# Altium schematic sheet MM-08 FPS-400.SchDoc
size A4; SheetNumber: 1; SheetTotal: 8
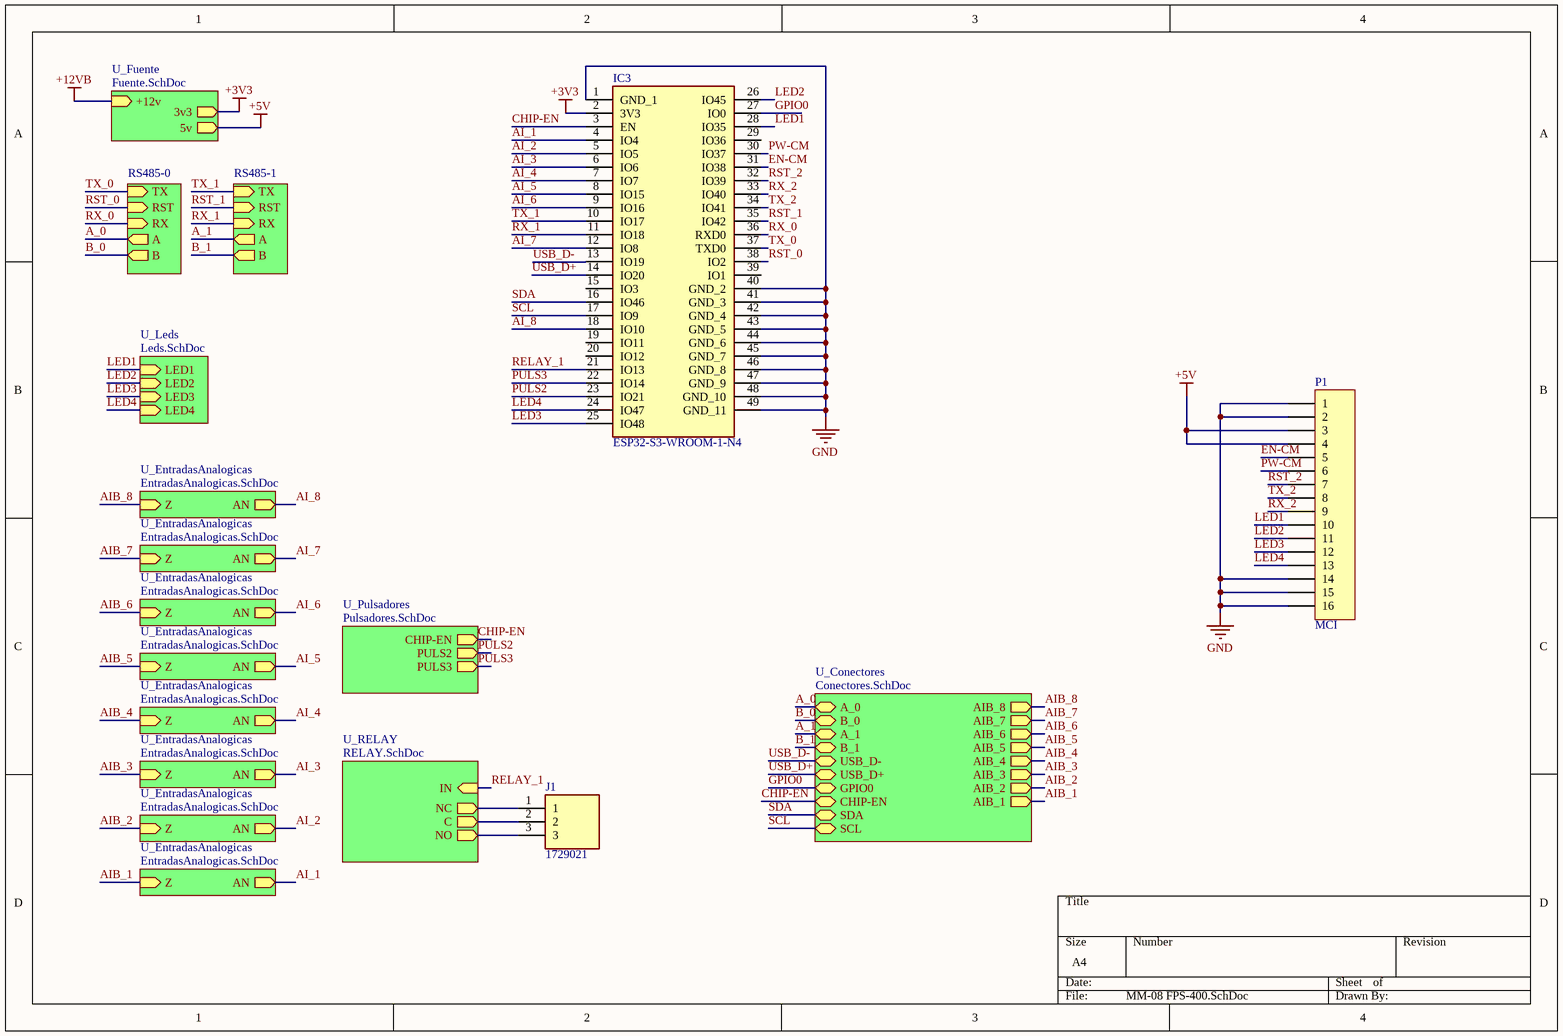
[diagram p0: MM-08 FPS-400.SchDoc]

## Parts
IC3  ESP32-S3-WROOM-1-N4  [Model Name]
J1  1729021  [1729021]
P1  MCI  [HDR1X16]

## Sub-sheets
RS485-0 = RS485.SchDoc: RST (in), RX (in), A (out), B (out), TX (in)
RS485-1 = RS485.SchDoc: RST (in), RX (in), A (out), B (out), TX (in)
U_Conectores = Conectores.SchDoc: A_0 (bidir), B_0 (bidir), A_1 (bidir), B_1 (bidir), USB_D- (bidir), USB_D+ (bidir), GPIO0 (bidir), CHIP-EN (bidir), SDA (bidir), SCL (bidir), AIB_3 (out), AIB_2 (out), AIB_6 (out), AIB_7 (out), AIB_5 (out), AIB_4 (out), AIB_1 (out), AIB_8 (out)
U_EntradasAnalogicas = EntradasAnalogicas.SchDoc: AN (out), Z (in)
U_EntradasAnalogicas = EntradasAnalogicas.SchDoc: AN (out), Z (in)
U_EntradasAnalogicas = EntradasAnalogicas.SchDoc: AN (out), Z (in)
U_EntradasAnalogicas = EntradasAnalogicas.SchDoc: AN (out), Z (in)
U_EntradasAnalogicas = EntradasAnalogicas.SchDoc: AN (out), Z (in)
U_EntradasAnalogicas = EntradasAnalogicas.SchDoc: AN (out), Z (in)
U_EntradasAnalogicas = EntradasAnalogicas.SchDoc: AN (out), Z (in)
U_EntradasAnalogicas = EntradasAnalogicas.SchDoc: AN (out), Z (in)
U_Fuente = Fuente.SchDoc: +12v (in), 3v3 (out), 5v (out)
U_Leds = Leds.SchDoc: LED1 (in), LED2 (in), LED3 (in), LED4 (in)
U_Pulsadores = Pulsadores.SchDoc: CHIP-EN (out), PULS2 (out), PULS3 (out)
U_RELAY = RELAY.SchDoc: IN (in), NC (out), C (out), NO (out)

## Nets
+3V3: IC3.2(3V3) ; sheet U_Fuente/3v3
+5V: P1.3 P1.4 ; sheet U_Fuente/5v
+12VB: sheet U_Fuente/+12v
GND: IC3.1(GND_1) IC3.40(GND_2) IC3.41(GND_3) IC3.42(GND_4) IC3.43(GND_5) IC3.44(GND_6) IC3.45(GND_7) IC3.46(GND_8) IC3.47(GND_9) IC3.48(GND_10) IC3.49(GND_11) P1.1 P1.2 P1.14 P1.15 P1.16
A_0: sheet RS485-0/A, sheet U_Conectores/A_0
A_1: sheet RS485-1/A, sheet U_Conectores/A_1
AI_1: IC3.4(IO4) ; sheet U_EntradasAnalogicas/AN
AI_2: IC3.5(IO5) ; sheet U_EntradasAnalogicas/AN
AI_3: IC3.6(IO6) ; sheet U_EntradasAnalogicas/AN
AI_4: IC3.7(IO7) ; sheet U_EntradasAnalogicas/AN
AI_5: IC3.8(IO15) ; sheet U_EntradasAnalogicas/AN
AI_6: IC3.9(IO16) ; sheet U_EntradasAnalogicas/AN
AI_7: IC3.12(IO8) ; sheet U_EntradasAnalogicas/AN
AI_8: IC3.18(IO10) ; sheet U_EntradasAnalogicas/AN
AIB_1: sheet U_Conectores/AIB_1, sheet U_EntradasAnalogicas/Z
AIB_2: sheet U_Conectores/AIB_2, sheet U_EntradasAnalogicas/Z
AIB_3: sheet U_Conectores/AIB_3, sheet U_EntradasAnalogicas/Z
AIB_4: sheet U_Conectores/AIB_4, sheet U_EntradasAnalogicas/Z
AIB_5: sheet U_Conectores/AIB_5, sheet U_EntradasAnalogicas/Z
AIB_6: sheet U_Conectores/AIB_6, sheet U_EntradasAnalogicas/Z
AIB_7: sheet U_Conectores/AIB_7, sheet U_EntradasAnalogicas/Z
AIB_8: sheet U_Conectores/AIB_8, sheet U_EntradasAnalogicas/Z
B_0: sheet RS485-0/B, sheet U_Conectores/B_0
B_1: sheet RS485-1/B, sheet U_Conectores/B_1
CHIP-EN: IC3.3(EN) ; sheet U_Conectores/CHIP-EN, sheet U_Pulsadores/CHIP-EN
EN-CM: IC3.31(IO38) P1.5
GPIO0: IC3.27(IO0) ; sheet U_Conectores/GPIO0
LED1: IC3.28(IO35) P1.10 ; sheet U_Leds/LED1
LED2: IC3.26(IO45) P1.11 ; sheet U_Leds/LED2
LED3: IC3.25(IO48) P1.12 ; sheet U_Leds/LED3
LED4: IC3.24(IO47) P1.13 ; sheet U_Leds/LED4
PULS2: IC3.23(IO21) ; sheet U_Pulsadores/PULS2
PULS3: IC3.22(IO14) ; sheet U_Pulsadores/PULS3
PW-CM: IC3.30(IO37) P1.6
RELAY_1: IC3.21(IO13) ; sheet U_RELAY/IN
RST_0: IC3.38(IO2) ; sheet RS485-0/RST
RST_1: IC3.35(IO42) ; sheet RS485-1/RST
RST_2: IC3.32(IO39) P1.7
RX_0: IC3.36(RXD0) ; sheet RS485-0/RX
RX_1: IC3.11(IO18) ; sheet RS485-1/RX
RX_2: IC3.33(IO40) P1.9
SCL: IC3.17(IO9) ; sheet U_Conectores/SCL
SDA: IC3.16(IO46) ; sheet U_Conectores/SDA
TX_0: IC3.37(TXD0) ; sheet RS485-0/TX
TX_1: IC3.10(IO17) ; sheet RS485-1/TX
TX_2: IC3.34(IO41) P1.8
USB_D+: IC3.14(IO20) ; sheet U_Conectores/USB_D+
USB_D-: IC3.13(IO19) ; sheet U_Conectores/USB_D-
NetJ1_1: J1.1 ; sheet U_RELAY/NC
NetJ1_2: J1.2 ; sheet U_RELAY/C
NetJ1_3: J1.3 ; sheet U_RELAY/NO

Not connected (* = marked no-connect by the designer): IC3 15(IO3) 19(IO11) 20(IO12) 29(IO36) 39(IO1)

## Library data of the parts
IC3 = ESP32-S3-WROOM-1-N4: Integrated Circuit; Manufacturer_Name: Espressif Systems; Datasheet Link: https://www.espressif.com/sites/default/files/documentation/esp32-s3-wroom-1_wroom-1u_datasheet_en.pdf; Height: 3.25mm; Manufacturer_Part_Number: ESP32-S3-WROOM-1-N4; Mouser Part Number: 356-ESP32-S3WROOM1N4; Mouser Price/Stock: https://www.mouser.co.uk/ProductDetail/Espressif-Systems/ESP32-S3-WROOM-1-N4?qs=Li%252BoUPsLEnsO%2FkiJOUK0FQ%3D%3D
J1 = 1729021: Connector; Manufacturer_Name: Phoenix Contact; Datasheet Link: http://www.phoenixcontact.com/de/produkte/1729021/pdf; Height: 10.15mm; Manufacturer_Part_Number: 1729021; Mouser Part Number: 651-1729021; Mouser Price/Stock: https://www.mouser.co.uk/ProductDetail/Phoenix-Contact/1729021?qs=zFpBqiaOpnwhKtz3PKBNAQ%3D%3D; Arrow Part Number: 1729021; Arrow Price/Stock: https://www.arrow.com/en/products/1729021/phoenix-contact?region=nac
P1 = Header 16: Header, 16-Pin; LatestRevisionDate: 17-Jul-2002; LatestRevisionNote: Re-released for DXP Platform.; Publisher: Altium Limited